# Altium project lab1_lyahovskij_USB_i2C.PrjPcb
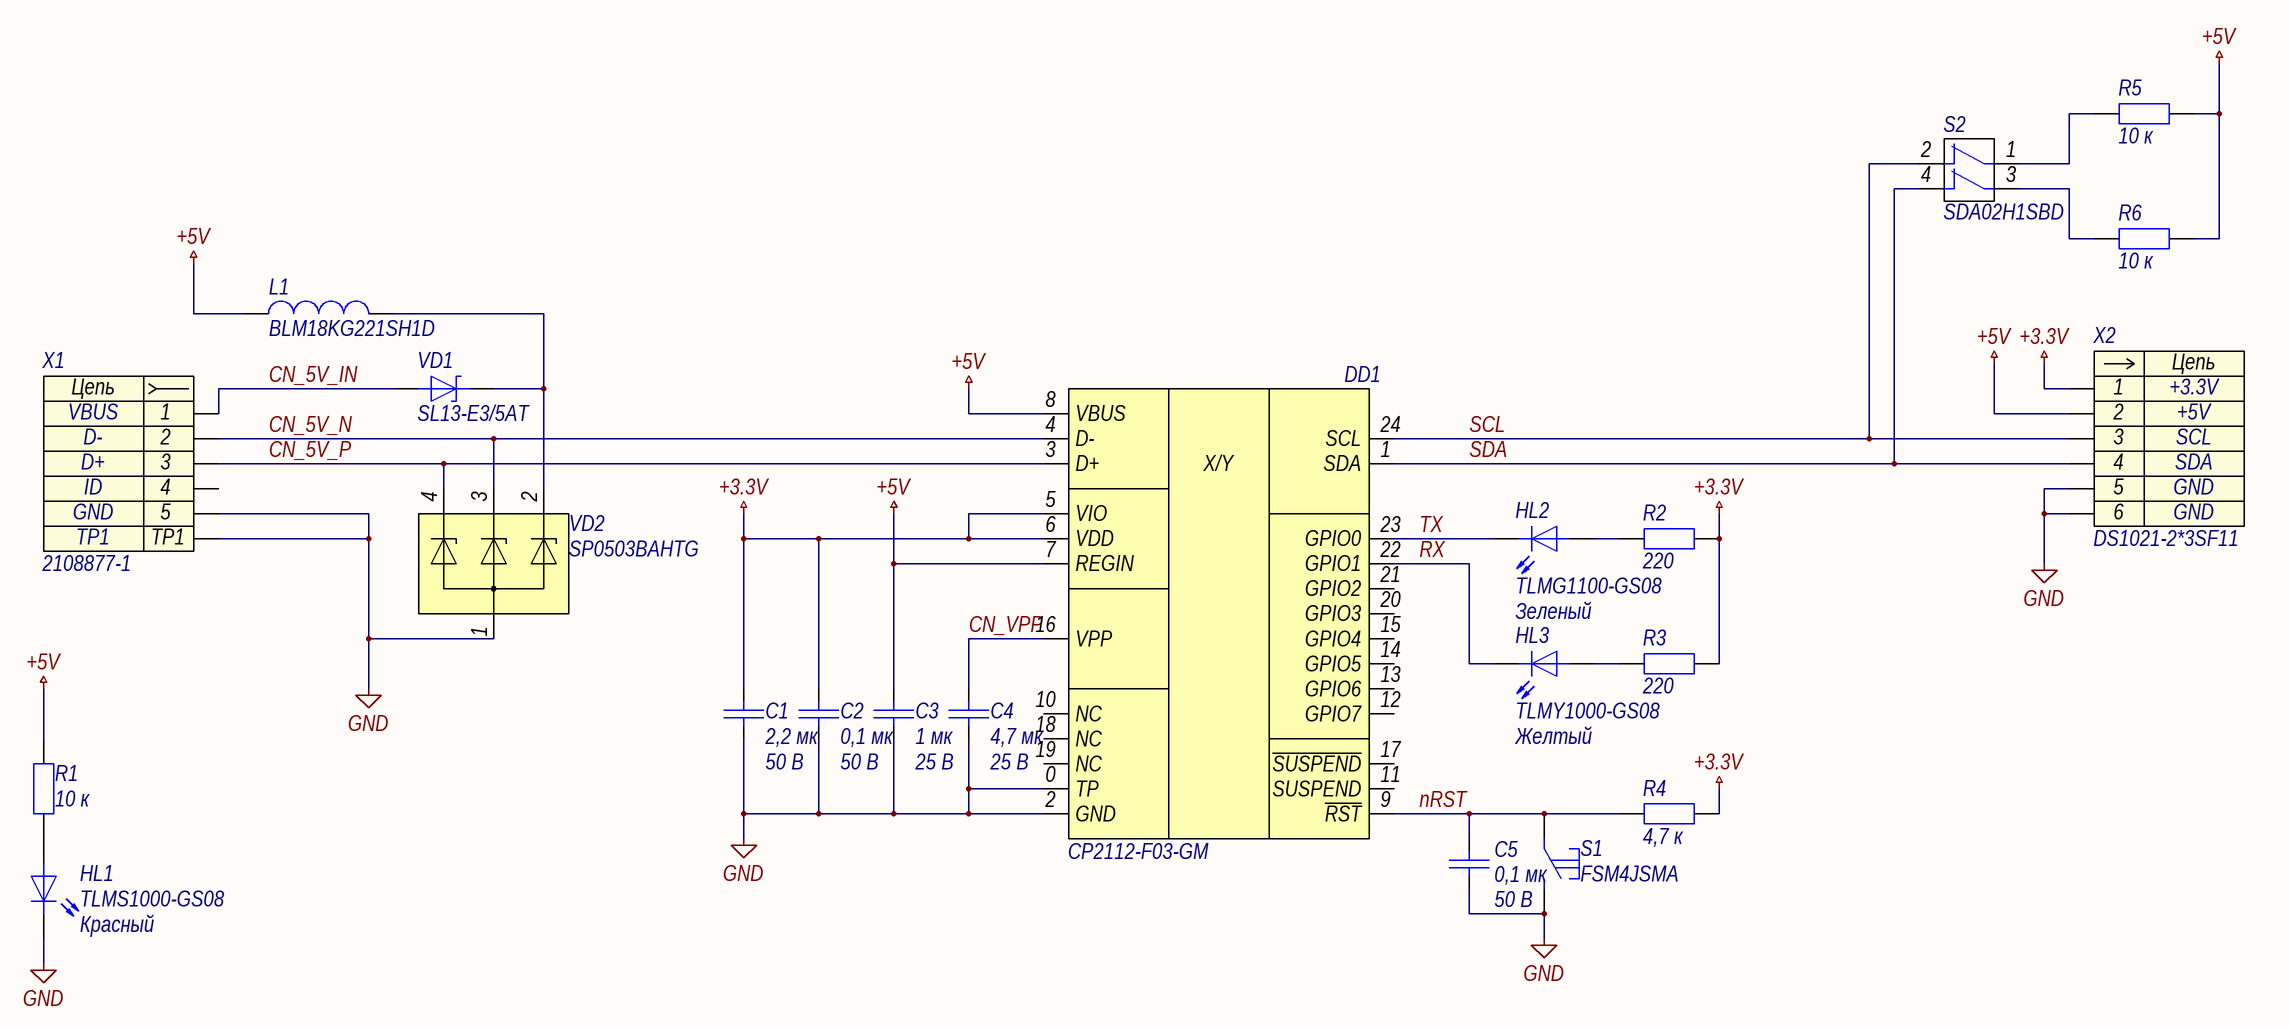
[diagram p0: lab1_lyahovskij_USB_I2C.SchDoc]
approver: Капустин; check: Капустин; designation: СПБПУ.3331506.018; developer: Ляховский; document_code: Ý3; document_type: Схема электрическая принципиальная; pcb_dec_number: СПБПУ.3331506.018; project: Лабораторная работа №1; title: Преобразователь USB-I2C; title_line_1: Преобразователь; title_line_2: USB-I2C
1 sheet, 22 parts. Net scope: global (net labels, ports and power ports of the same name join across sheets).
Board file: lab1_lyahovskij_USB_I2C.PcbDoc

## Sheet lab1_lyahovskij_USB_I2C.SchDoc: Преобразователь USB-I2C
size 594 x 420 mm; ApprovedBy: Капустин; CheckedBy: Капустин; DrawnBy: Ляховский; DocumentNumber: СПБПУ.3331506.018Ý3; SheetNumber: n; DocumentCode: Ý3; ImagePath: СПБПУ.3331506.018

### Parts
C1  2,2 мк  Напряжение: 50 В  [C0603]
C2  0,1 мк  Напряжение: 50 В  [C0603]
C3  1 мк  Напряжение: 25 В  [C0603]
C4  4,7 мк  Напряжение: 25 В  [C0603]
C5  0,1 мк  Напряжение: 50 В  [C0603]
DD1  CP2112-F03-GM  [QFN-24-400X400X80]
HL1  TLMS1000-GS08  Colour: Красный  [HL0603]
HL2  TLMG1100-GS08  Colour: Зеленый  [HL0603]
HL3  TLMY1000-GS08  Colour: Желтый  [HL0603]
L1  BLM18KG221SH1D  [BLM-2-0603]
R1  10 к  [R0603]
R2  220  [R0603]
R3  220  [R0603]
R4  4,7 к  [R0603]
R5  10 к  [R0603]
R6  10 к  [R0603]
S1  FSM4JSMA  [FSM4JSMA]
S2  SDA02H1SBD  [SDA02H1SBD]
VD1  SL13-E3/5AT  [DO-214AC]
VD2  SP0503BAHTG  [SOT-143-4]
X1  2108877-1  [2108877-1]
X2  DS1021-2*3SF11  [DS1021-2X3SF11]

### Nets
+3.3V: C1.1 C2.1 DD1.5(VIO) DD1.6(VDD) R2.2 R3.2 R4.1 X2.1
+5V: C3.1 DD1.7(REGIN) DD1.8(VBUS) L1.2 R1.2 R5.2 R6.2 X2.2
GND: C1.2 C2.2 C3.2 C4.2 C5.2 DD1.0(TP) DD1.2(GND) HL1.1 S1.2 VD2.1 X1.5 X1.TP1 X2.5 X2.6
CN_5V_IN: VD1.2 X1.1
CN_5V_N: DD1.4(D-) VD2.3 X1.2
CN_5V_P: DD1.3(D+) VD2.4 X1.3
CN_VPP: C4.1 DD1.16(VPP)
nRST: C5.1 DD1.9(~{RST}) R4.2 S1.1
RX: DD1.22(GPIO1) HL3.1
SCL: DD1.24(SCL) S2.2 X2.3
SDA: DD1.1(SDA) S2.4 X2.4
TX: DD1.23(GPIO0) HL2.1
NetHL1_2: HL1.2 R1.1
NetHL2_2: HL2.2 R2.1
NetHL3_2: HL3.2 R3.1
NetL1_1: L1.1 VD1.1 VD2.2
NetR5_1: R5.1 S2.1
NetR6_1: R6.1 S2.3

Not connected (* = marked no-connect by the designer): DD1 10(NC) 11(SUSPEND) 12(GPIO7) 13(GPIO6) 14(GPIO5) 15(GPIO4) 17(~{SUSPEND}) 18(NC) 19(NC) 20(GPIO3) 21(GPIO2); X1 4

### Notes on the sheet
- Перв. примен.
- Справ. №
- Подп. и дата
- Инв. № дубл.
- Нормоконтроль:
- Взам. инв. №
- Изм.
- Лист
- № докум.
- Подп.
- Дата
- Лит.
- Масса
- Масштаб
- Т.контр.
- Пров.
- Разраб.
- Листов
- Разработал:
- Инв. № подл.
- Н.контр.
- Утв.
- Копировал
- Формат
- А2
- (in symbol dd0005) X/Y
- (in symbol x0001) Цепь
- (in symbol x0003) Цепь

### Library data of the parts
C1 = c0102: =Описание; ID: c0102; Фамилия: Самарин; Описание: Конденсатор керамический чип 0603 2,2 мкФ 50 В ±10 %; Наименование: CC0603KRX5R9BB225; Производитель: YAGEO Corp.; Отклонение: ±10 %; Рабочие температуры: от –55 °С до +85 °С; Температурный коэффициент емкости: X5R; Корпус: 0603; Номинал: 2,2 мк; Номинальное напряжение: 50 В; HelpURL: https://www.yageo.com/upload/media/product/productsearch/datasheet/mlcc/UPY-GPHC_X5R_4V-to-50V_26.pdf
C2 C5 = c0060: =Описание; ID: c0060; Фамилия: Ларионов; Описание: Конденсатор керамический чип 0603 100 нФ 50 В ±5 %; Наименование: CC0603JRX7R9BB104; Производитель: YAGEO Corp.; Отклонение: ±5 %; Рабочие температуры: от –55 °С до +125 °С; Температурный коэффициент емкости: X7R; Корпус: 0603; Номинал: 0,1 мк; Номинальное напряжение: 50 В; HelpURL: https://www.yageo.com/upload/media/product/productsearch/datasheet/mlcc/UPY-GPHC_X7R_6.3V-to-50V_20.pdf
C3 = c0090: =Описание; ID: c0090; Фамилия: Ларионов; Описание: Конденсатор керамический чип 0603 1 мкФ 25 В ±10 %; Наименование: CC0603KRX7R8BB105; Производитель: YAGEO Corp.; Отклонение: ±10 %; Рабочие температуры: от –55 °С до +125 °С; Температурный коэффициент емкости: X7R; Корпус: 0603; Номинал: 1 мк; Номинальное напряжение: 25 В; HelpURL: https://www.yageo.com/upload/media/product/productsearch/datasheet/mlcc/UPY-GPHC_X7R_6.3V-to-50V_20.pdf
C4 = c0111: =Описание; ID: c0111; Фамилия: Ларионов; Описание: Конденсатор керамический чип 0603 4,7 мкФ 25 В ±10 %; Наименование: CC0603KRX5R8BB475; Производитель: YAGEO Corp.; Отклонение: ±10 %; Рабочие температуры: от –55 °С до +85 °С; Температурный коэффициент емкости: X5R; Корпус: 0603; Номинал: 4,7 мк; Номинальное напряжение: 25 В; HelpURL: https://www.yageo.com/upload/media/product/productsearch/datasheet/mlcc/UPY-GPHC_X5R_4V-to-50V_26.pdf
DD1 = dd0005: =Описание; ID: dd0005; Фамилия: Ляховский; Описание: Преобразователь USB-SPI; Производитель: Silicon Laboratories; Корпус: QFN-24; Наименование: CP2112-F03-GM; HelpURL: https://www.silabs.com/interface/usb-bridges/classic/device.cp2112
HL1 = hl0001: =Описание; ID: hl0001; Фамилия: Ларионов; Описание: Светодиод чип 0603 красный; Производитель: Vishay Intertechnology, Inc.; Номинальная сила света: 4 мкд; Номинальная длина волны: 628 нм; Номинальный прямой ток: 15 мА; Номинальное падение напряжения: 1,8 В; Рассеиваемая мощность: 40 мВт; Рабочие температуры: от –40 °С до +100 °С; Корпус: 0603; Наименование: TLMS1000-GS08; Цвет: Красный; HelpURL: https://www.vishay.com/leds/list/product-83172/
HL2 = hl0005: =Описание; ID: hl0005; Фамилия: Ларионов; Описание: Светодиод чип 0603 зеленый; Производитель: Vishay Intertechnology, Inc.; Номинальная сила света: 35 мкд; Номинальная длина волны: 570 нм; Номинальный прямой ток: 30 мА; Номинальное падение напряжения: 2,1 В; Рассеиваемая мощность: 90 мВт; Рабочие температуры: от –40 °С до +100 °С; Корпус: 0603; Наименование: TLMG1100-GS08; Цвет: Зеленый; HelpURL: https://www.vishay.com/leds/list/product-83173/
HL3 = hl0003: =Описание; ID: hl0003; Фамилия: Ларионов; Описание: Светодиод чип 0603 желтый; Производитель: Vishay Intertechnology, Inc.; Номинальная сила света: 7,5 мкд; Номинальная длина волны: 588 нм; Номинальный прямой ток: 15 мА; Номинальное падение напряжения: 1,8 В; Рассеиваемая мощность: 40 мВт; Рабочие температуры: от –40 °С до +100 °С; Корпус: 0603; Наименование: TLMY1000-GS08; Цвет: Желтый; HelpURL: https://www.vishay.com/leds/list/product-83172/
L1 = l0001: =Описание; ID: l0001; Фамилия: Ларионов; Описание: Ферритовая бусина 220 Ом ±25 %; Производитель: Murata Manufacturing Co., Ltd.; Сопротивление, 100 МГц: 220 Ом; Отклонение, 100 Мгц: ±25 %; Сопротивление при постоянном токе: 0,05 Ом; Рабочие температуры: от -55 °С до +125 °С; Корпус: 0603; Наименование: BLM18KG221SH1D; HelpURL: https://www.murata.com/en-global/products/productdetail.aspx?partno=BLM18KG221SH1%23
R1 R5 R6 = r0012: =Описание; ID: r0012; Фамилия: Самарин; Описание: Резистор чип 0603 10 кОм ±1 % 0,1 Вт; Наименование: RC0603FR-0710KL; Производитель: Yageo; Отклонение: ±1 %; Номинальное напряжение: 75 В; Рабочие температуры: от -55 °С до +155 °С; Номинальный ток: 1 А; Корпус: 0603; Номинал: 10 к; HelpURL: https://www.yageo.com/upload/media/product/productsearch/datasheet/rchip/PYu-RC_Group_51_RoHS_L_11.pdf
R2 R3 = r0008: =Описание; ID: r0008; Фамилия: Ларионов; Описание: Резистор чип 0603 220 Ом ±1 % 0,1 Вт; Наименование: RC0603FR-07220RL; Производитель: Yageo; Отклонение: ±1 %; Номинальное напряжение: 75 В; Рабочие температуры: от -55 °С до +155 °С; Номинальный ток: 1 А; Корпус: 0603; Номинал: 220; HelpURL: https://www.yageo.com/upload/media/product/productsearch/datasheet/rchip/PYu-RC_Group_51_RoHS_L_11.pdf
R4 = r0007: =Описание; ID: r0007; Фамилия: Ларионов; Описание: Резистор чип 0603 4,7 кОм ±1 % 0,1 Вт; Наименование: RC0603FR-074K7L; Производитель: Yageo; Отклонение: ±1 %; Номинальное напряжение: 75 В; Рабочие температуры: от -55 °С до +155 °С; Номинальный ток: 1 А; Корпус: 0603; Номинал: 4,7 к; HelpURL: https://www.yageo.com/upload/media/product/productsearch/datasheet/rchip/PYu-RC_Group_51_RoHS_L_11.pdf
S1 = sw0002: =Описание; ID: sw0002; Фамилия: Паньков; Описание: Тактовая кнопка поверхностного монтажа; Производитель: TE Connectivity; Ток нагрузки: 50 мА @ 24 В; Сопротивление контакта: 100 мОм; Количество контактов: 1; Рабочие температуры: от –35 °С до +85 °С; Промывка: Разрешена; Корпус: 6,00x6,00x4,98; Наименование: FSM4JSMA; HelpURL: https://www.te.com/usa-en/product-4-1437565-1.html
S2 = s0006: =Описание; ID: s0006; Фамилия: Козлов; Описание: 2-х позиционный движковый переключатель; Производитель: C&K; Ток нагрузки: 100 мА @ 5 В; Сопротивление контакта: 50 мОм; Количество контактов: 4; Рабочие температуры: от –40 °С до +85 °С; Промывка: Запрещена; Корпус: 7,06 х 9,30 х 5,45; Наименование: SDA02H1SBD; HelpURL: https://www.ckswitches.com/products/switches/product-details/DIP/SDA/SDA02H1SBD/
VD1 = vd0003: =Описание; ID: vd0003; Фамилия: Ларионов; Описание: Диод Шоттки 30 В 1,5 А; Производитель: Vishay Intertechnology, Inc.; Максимальное прямое напряжение: 0,445 В; Максимальное обратное напряжение: 30 В; Максимальный прямой ток: 1,5 А; Рабочие температуры: от –55 °С до +125 °С; Наименование: SL13-E3/5AT; Корпус: DO-214AC; HelpURL: https://www.vishay.com/product?docid=88740
VD2 = vd0001: =Описание; ID: vd0001; Фамилия: Ларионов; Описание: Диодная сборка для подавления помех, 5 В; Производитель: Littelfuse, Inc.; Наименование: SP0503BAHTG; Корпус: SOT-143-4; HelpURL: https://www.littelfuse.com/products/tvs-diode-arrays/general-purpose-esd-protection/sp050xba-lead-free-green.aspx
X1 = x0001: =Описание; Contact_1: VBUS; Contact_2: D-; Contact_3: D+; Contact_4: ID; Contact_5: GND; ID: x0001; Фамилия: Ларионов; Описание: Micro USB Type B IP68 гнездо; Производитель: TE Connectivity; Наименование: 2108877-1; HelpURL: https://www.te.com/global-en/product-2108877-1.html
X2 = x0003: =Описание; Contact_1: +3.3V; Contact_2: +5V; Contact_3: SCL; Contact_4: SDA; Contact_5: GND; ID: x0003; Фамилия: Самарин; Описание: PLS 3x2 pin 2,54 мм вилка прямой; Производитель: Connfly Electronic Co. LTD; Contact_6: GND; Наименование: DS1021-2*3SF11; HelpURL: http://www.connfly.com/productshow.aspx?id=118